# Altium schematic sheet 驱动板.SchDoc
size A3
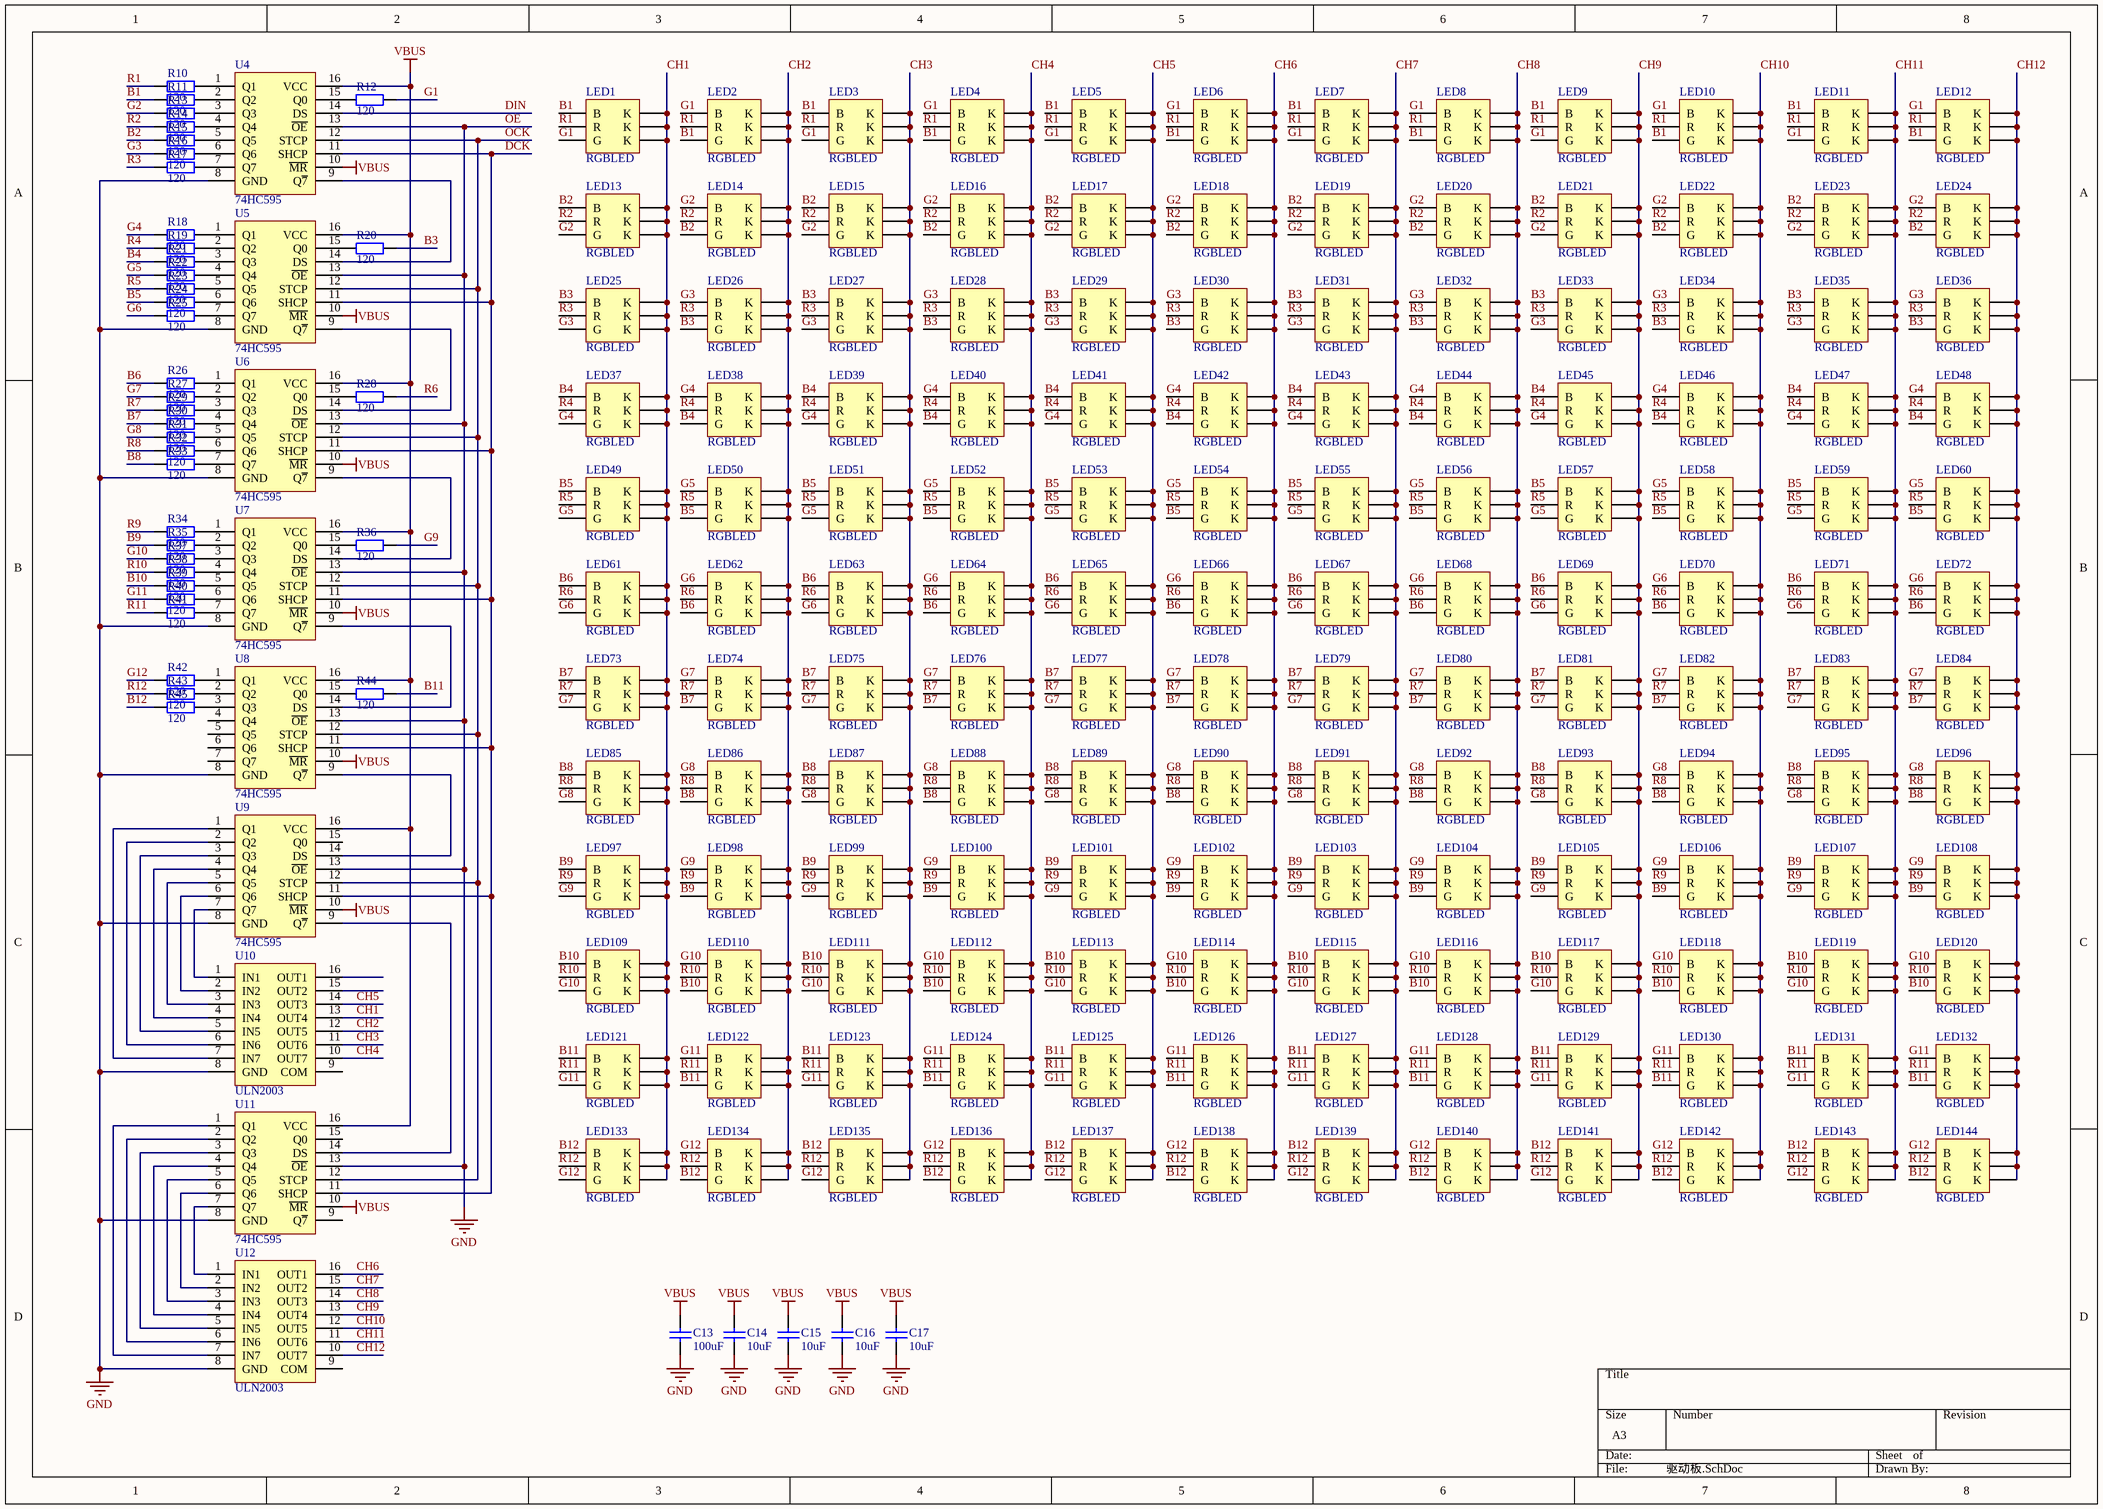
[diagram p0: 驱动板.SchDoc]

## Parts
C13  100uF  [2512]
C14  10uF  [0805]
C15  10uF  [0805]
C16  10uF  [0805]
C17  10uF  [0805]
LED1  RGBLED  [5050]
LED2  RGBLED  [5050]
LED3  RGBLED  [5050]
LED4  RGBLED  [5050]
LED5  RGBLED  [5050]
LED6  RGBLED  [5050]
LED7  RGBLED  [5050]
LED8  RGBLED  [5050]
LED9  RGBLED  [5050]
LED10  RGBLED  [5050]
LED11  RGBLED  [5050]
LED12  RGBLED  [5050]
LED13  RGBLED  [5050]
LED14  RGBLED  [5050]
LED15  RGBLED  [5050]
LED16  RGBLED  [5050]
LED17  RGBLED  [5050]
LED18  RGBLED  [5050]
LED19  RGBLED  [5050]
LED20  RGBLED  [5050]
LED21  RGBLED  [5050]
LED22  RGBLED  [5050]
LED23  RGBLED  [5050]
LED24  RGBLED  [5050]
LED25  RGBLED  [5050]
LED26  RGBLED  [5050]
LED27  RGBLED  [5050]
LED28  RGBLED  [5050]
LED29  RGBLED  [5050]
LED30  RGBLED  [5050]
LED31  RGBLED  [5050]
LED32  RGBLED  [5050]
LED33  RGBLED  [5050]
LED34  RGBLED  [5050]
LED35  RGBLED  [5050]
LED36  RGBLED  [5050]
LED37  RGBLED  [5050]
LED38  RGBLED  [5050]
LED39  RGBLED  [5050]
LED40  RGBLED  [5050]
LED41  RGBLED  [5050]
LED42  RGBLED  [5050]
LED43  RGBLED  [5050]
LED44  RGBLED  [5050]
LED45  RGBLED  [5050]
LED46  RGBLED  [5050]
LED47  RGBLED  [5050]
LED48  RGBLED  [5050]
LED49  RGBLED  [5050]
LED50  RGBLED  [5050]
LED51  RGBLED  [5050]
LED52  RGBLED  [5050]
LED53  RGBLED  [5050]
LED54  RGBLED  [5050]
LED55  RGBLED  [5050]
LED56  RGBLED  [5050]
LED57  RGBLED  [5050]
LED58  RGBLED  [5050]
LED59  RGBLED  [5050]
LED60  RGBLED  [5050]
LED61  RGBLED  [5050]
LED62  RGBLED  [5050]
LED63  RGBLED  [5050]
LED64  RGBLED  [5050]
LED65  RGBLED  [5050]
LED66  RGBLED  [5050]
LED67  RGBLED  [5050]
LED68  RGBLED  [5050]
LED69  RGBLED  [5050]
LED70  RGBLED  [5050]
LED71  RGBLED  [5050]
LED72  RGBLED  [5050]
LED73  RGBLED  [5050]
LED74  RGBLED  [5050]
LED75  RGBLED  [5050]
LED76  RGBLED  [5050]
LED77  RGBLED  [5050]
LED78  RGBLED  [5050]
LED79  RGBLED  [5050]
LED80  RGBLED  [5050]
LED81  RGBLED  [5050]
LED82  RGBLED  [5050]
LED83  RGBLED  [5050]
LED84  RGBLED  [5050]
LED85  RGBLED  [5050]
LED86  RGBLED  [5050]
LED87  RGBLED  [5050]
LED88  RGBLED  [5050]
LED89  RGBLED  [5050]
LED90  RGBLED  [5050]
LED91  RGBLED  [5050]
LED92  RGBLED  [5050]
LED93  RGBLED  [5050]
LED94  RGBLED  [5050]
LED95  RGBLED  [5050]
LED96  RGBLED  [5050]
LED97  RGBLED  [5050]
LED98  RGBLED  [5050]
LED99  RGBLED  [5050]
LED100  RGBLED  [5050]
LED101  RGBLED  [5050]
LED102  RGBLED  [5050]
LED103  RGBLED  [5050]
LED104  RGBLED  [5050]
LED105  RGBLED  [5050]
LED106  RGBLED  [5050]
LED107  RGBLED  [5050]
LED108  RGBLED  [5050]
LED109  RGBLED  [5050]
LED110  RGBLED  [5050]
LED111  RGBLED  [5050]
LED112  RGBLED  [5050]
LED113  RGBLED  [5050]
LED114  RGBLED  [5050]
LED115  RGBLED  [5050]
LED116  RGBLED  [5050]
LED117  RGBLED  [5050]
LED118  RGBLED  [5050]
LED119  RGBLED  [5050]
LED120  RGBLED  [5050]
LED121  RGBLED  [5050]
LED122  RGBLED  [5050]
LED123  RGBLED  [5050]
LED124  RGBLED  [5050]
LED125  RGBLED  [5050]
LED126  RGBLED  [5050]
LED127  RGBLED  [5050]
LED128  RGBLED  [5050]
LED129  RGBLED  [5050]
LED130  RGBLED  [5050]
LED131  RGBLED  [5050]
LED132  RGBLED  [5050]
LED133  RGBLED  [5050]
LED134  RGBLED  [5050]
LED135  RGBLED  [5050]
LED136  RGBLED  [5050]
LED137  RGBLED  [5050]
LED138  RGBLED  [5050]
LED139  RGBLED  [5050]
LED140  RGBLED  [5050]
LED141  RGBLED  [5050]
LED142  RGBLED  [5050]
LED143  RGBLED  [5050]
LED144  RGBLED  [5050]
R10  120  [0805]
R11  120  [0805]
R12  120  [0805]
R13  120  [0805]
R14  120  [0805]
R15  120  [0805]
R16  120  [0805]
R17  120  [0805]
R18  120  [0805]
R19  120  [0805]
R20  120  [0805]
R21  120  [0805]
R22  120  [0805]
R23  120  [0805]
R24  120  [0805]
R25  120  [0805]
R26  120  [0805]
R27  120  [0805]
R28  120  [0805]
R29  120  [0805]
R30  120  [0805]
R31  120  [0805]
R32  120  [0805]
R33  120  [0805]
R34  120  [0805]
R35  120  [0805]
R36  120  [0805]
R37  120  [0805]
R38  120  [0805]
R39  120  [0805]
R40  120  [0805]
R41  120  [0805]
R42  120  [0805]
R43  120  [0805]
R44  120  [0805]
R45  120  [0805]
U4  74HC595  [SO-16_N]
U5  74HC595  [SO-16_N]
U6  74HC595  [SO-16_N]
U7  74HC595  [SO-16_N]
U8  74HC595  [SO-16_N]
U9  74HC595  [SO-16_N]
U10  ULN2003  [SO-16_N]
U11  74HC595  [SO-16_N]
U12  ULN2003  [SO-16_N]

## Nets
OE: C13.2 C14.2 C15.2 C16.2 C17.2 U4.8(GND) U4.13(~{OE}) U5.8(GND) U5.13(~{OE}) U6.8(GND) U6.13(~{OE}) U7.8(GND) U7.13(~{OE}) U8.8(GND) U8.13(~{OE}) U9.8(GND) U9.13(~{OE}) U10.8(GND) U11.8(GND) U11.13(~{OE}) U12.8(GND)  [also labelled GND]
VBUS: C13.1 C14.1 C15.1 C16.1 C17.1 U4.10(~{MR}) U4.16(VCC) U5.10(~{MR}) U5.16(VCC) U6.10(~{MR}) U6.16(VCC) U7.10(~{MR}) U7.16(VCC) U8.10(~{MR}) U8.16(VCC) U9.10(~{MR}) U9.16(VCC) U11.10(~{MR}) U11.16(VCC)
B1: LED1.1(B) LED2.3(G) LED3.1(B) LED4.3(G) LED5.1(B) LED6.3(G) LED7.1(B) LED8.3(G) LED9.1(B) LED10.3(G) LED11.1(B) LED12.3(G) R11.1
B2: LED13.1(B) LED14.3(G) LED15.1(B) LED16.3(G) LED17.1(B) LED18.3(G) LED19.1(B) LED20.3(G) LED21.1(B) LED22.3(G) LED23.1(B) LED24.3(G) R15.1
B3: LED25.1(B) LED26.3(G) LED27.1(B) LED28.3(G) LED29.1(B) LED30.3(G) LED31.1(B) LED32.3(G) LED33.1(B) LED34.3(G) LED35.1(B) LED36.3(G) R20.2
B4: LED37.1(B) LED38.3(G) LED39.1(B) LED40.3(G) LED41.1(B) LED42.3(G) LED43.1(B) LED44.3(G) LED45.1(B) LED46.3(G) LED47.1(B) LED48.3(G) R21.1
B5: LED49.1(B) LED50.3(G) LED51.1(B) LED52.3(G) LED53.1(B) LED54.3(G) LED55.1(B) LED56.3(G) LED57.1(B) LED58.3(G) LED59.1(B) LED60.3(G) R24.1
B6: LED61.1(B) LED62.3(G) LED63.1(B) LED64.3(G) LED65.1(B) LED66.3(G) LED67.1(B) LED68.3(G) LED69.1(B) LED70.3(G) LED71.1(B) LED72.3(G) R26.1
B7: LED73.1(B) LED74.3(G) LED75.1(B) LED76.3(G) LED77.1(B) LED78.3(G) LED79.1(B) LED80.3(G) LED81.1(B) LED82.3(G) LED83.1(B) LED84.3(G) R30.1
B8: LED85.1(B) LED86.3(G) LED87.1(B) LED88.3(G) LED89.1(B) LED90.3(G) LED91.1(B) LED92.3(G) LED93.1(B) LED94.3(G) LED95.1(B) LED96.3(G) R33.1
B9: LED97.1(B) LED98.3(G) LED99.1(B) LED100.3(G) LED101.1(B) LED102.3(G) LED103.1(B) LED104.3(G) LED105.1(B) LED106.3(G) LED107.1(B) LED108.3(G) R35.1
B10: LED109.1(B) LED110.3(G) LED111.1(B) LED112.3(G) LED113.1(B) LED114.3(G) LED115.1(B) LED116.3(G) LED117.1(B) LED118.3(G) LED119.1(B) LED120.3(G) R39.1
B11: LED121.1(B) LED122.3(G) LED123.1(B) LED124.3(G) LED125.1(B) LED126.3(G) LED127.1(B) LED128.3(G) LED129.1(B) LED130.3(G) LED131.1(B) LED132.3(G) R44.2
B12: LED133.1(B) LED134.3(G) LED135.1(B) LED136.3(G) LED137.1(B) LED138.3(G) LED139.1(B) LED140.3(G) LED141.1(B) LED142.3(G) LED143.1(B) LED144.3(G) R45.1
CH1: LED1.4(K) LED1.5(K) LED1.6(K) LED13.4(K) LED13.5(K) LED13.6(K) LED25.4(K) LED25.5(K) LED25.6(K) LED37.4(K) LED37.5(K) LED37.6(K) LED49.4(K) LED49.5(K) LED49.6(K) LED61.4(K) LED61.5(K) LED61.6(K) LED73.4(K) LED73.5(K) LED73.6(K) LED85.4(K) LED85.5(K) LED85.6(K) LED97.4(K) LED97.5(K) LED97.6(K) LED109.4(K) LED109.5(K) LED109.6(K) LED121.4(K) LED121.5(K) LED121.6(K) LED133.4(K) LED133.5(K) LED133.6(K) U10.13(OUT4)
CH2: LED2.4(K) LED2.5(K) LED2.6(K) LED14.4(K) LED14.5(K) LED14.6(K) LED26.4(K) LED26.5(K) LED26.6(K) LED38.4(K) LED38.5(K) LED38.6(K) LED50.4(K) LED50.5(K) LED50.6(K) LED62.4(K) LED62.5(K) LED62.6(K) LED74.4(K) LED74.5(K) LED74.6(K) LED86.4(K) LED86.5(K) LED86.6(K) LED98.4(K) LED98.5(K) LED98.6(K) LED110.4(K) LED110.5(K) LED110.6(K) LED122.4(K) LED122.5(K) LED122.6(K) LED134.4(K) LED134.5(K) LED134.6(K) U10.12(OUT5)
CH3: LED3.4(K) LED3.5(K) LED3.6(K) LED15.4(K) LED15.5(K) LED15.6(K) LED27.4(K) LED27.5(K) LED27.6(K) LED39.4(K) LED39.5(K) LED39.6(K) LED51.4(K) LED51.5(K) LED51.6(K) LED63.4(K) LED63.5(K) LED63.6(K) LED75.4(K) LED75.5(K) LED75.6(K) LED87.4(K) LED87.5(K) LED87.6(K) LED99.4(K) LED99.5(K) LED99.6(K) LED111.4(K) LED111.5(K) LED111.6(K) LED123.4(K) LED123.5(K) LED123.6(K) LED135.4(K) LED135.5(K) LED135.6(K) U10.11(OUT6)
CH4: LED4.4(K) LED4.5(K) LED4.6(K) LED16.4(K) LED16.5(K) LED16.6(K) LED28.4(K) LED28.5(K) LED28.6(K) LED40.4(K) LED40.5(K) LED40.6(K) LED52.4(K) LED52.5(K) LED52.6(K) LED64.4(K) LED64.5(K) LED64.6(K) LED76.4(K) LED76.5(K) LED76.6(K) LED88.4(K) LED88.5(K) LED88.6(K) LED100.4(K) LED100.5(K) LED100.6(K) LED112.4(K) LED112.5(K) LED112.6(K) LED124.4(K) LED124.5(K) LED124.6(K) LED136.4(K) LED136.5(K) LED136.6(K) U10.10(OUT7)
CH5: LED5.4(K) LED5.5(K) LED5.6(K) LED17.4(K) LED17.5(K) LED17.6(K) LED29.4(K) LED29.5(K) LED29.6(K) LED41.4(K) LED41.5(K) LED41.6(K) LED53.4(K) LED53.5(K) LED53.6(K) LED65.4(K) LED65.5(K) LED65.6(K) LED77.4(K) LED77.5(K) LED77.6(K) LED89.4(K) LED89.5(K) LED89.6(K) LED101.4(K) LED101.5(K) LED101.6(K) LED113.4(K) LED113.5(K) LED113.6(K) LED125.4(K) LED125.5(K) LED125.6(K) LED137.4(K) LED137.5(K) LED137.6(K) U10.14(OUT3)
CH6: LED6.4(K) LED6.5(K) LED6.6(K) LED18.4(K) LED18.5(K) LED18.6(K) LED30.4(K) LED30.5(K) LED30.6(K) LED42.4(K) LED42.5(K) LED42.6(K) LED54.4(K) LED54.5(K) LED54.6(K) LED66.4(K) LED66.5(K) LED66.6(K) LED78.4(K) LED78.5(K) LED78.6(K) LED90.4(K) LED90.5(K) LED90.6(K) LED102.4(K) LED102.5(K) LED102.6(K) LED114.4(K) LED114.5(K) LED114.6(K) LED126.4(K) LED126.5(K) LED126.6(K) LED138.4(K) LED138.5(K) LED138.6(K) U12.16(OUT1)
CH7: LED7.4(K) LED7.5(K) LED7.6(K) LED19.4(K) LED19.5(K) LED19.6(K) LED31.4(K) LED31.5(K) LED31.6(K) LED43.4(K) LED43.5(K) LED43.6(K) LED55.4(K) LED55.5(K) LED55.6(K) LED67.4(K) LED67.5(K) LED67.6(K) LED79.4(K) LED79.5(K) LED79.6(K) LED91.4(K) LED91.5(K) LED91.6(K) LED103.4(K) LED103.5(K) LED103.6(K) LED115.4(K) LED115.5(K) LED115.6(K) LED127.4(K) LED127.5(K) LED127.6(K) LED139.4(K) LED139.5(K) LED139.6(K) U12.15(OUT2)
CH8: LED8.4(K) LED8.5(K) LED8.6(K) LED20.4(K) LED20.5(K) LED20.6(K) LED32.4(K) LED32.5(K) LED32.6(K) LED44.4(K) LED44.5(K) LED44.6(K) LED56.4(K) LED56.5(K) LED56.6(K) LED68.4(K) LED68.5(K) LED68.6(K) LED80.4(K) LED80.5(K) LED80.6(K) LED92.4(K) LED92.5(K) LED92.6(K) LED104.4(K) LED104.5(K) LED104.6(K) LED116.4(K) LED116.5(K) LED116.6(K) LED128.4(K) LED128.5(K) LED128.6(K) LED140.4(K) LED140.5(K) LED140.6(K) U12.14(OUT3)
CH9: LED9.4(K) LED9.5(K) LED9.6(K) LED21.4(K) LED21.5(K) LED21.6(K) LED33.4(K) LED33.5(K) LED33.6(K) LED45.4(K) LED45.5(K) LED45.6(K) LED57.4(K) LED57.5(K) LED57.6(K) LED69.4(K) LED69.5(K) LED69.6(K) LED81.4(K) LED81.5(K) LED81.6(K) LED93.4(K) LED93.5(K) LED93.6(K) LED105.4(K) LED105.5(K) LED105.6(K) LED117.4(K) LED117.5(K) LED117.6(K) LED129.4(K) LED129.5(K) LED129.6(K) LED141.4(K) LED141.5(K) LED141.6(K) U12.13(OUT4)
CH10: LED10.4(K) LED10.5(K) LED10.6(K) LED22.4(K) LED22.5(K) LED22.6(K) LED34.4(K) LED34.5(K) LED34.6(K) LED46.4(K) LED46.5(K) LED46.6(K) LED58.4(K) LED58.5(K) LED58.6(K) LED70.4(K) LED70.5(K) LED70.6(K) LED82.4(K) LED82.5(K) LED82.6(K) LED94.4(K) LED94.5(K) LED94.6(K) LED106.4(K) LED106.5(K) LED106.6(K) LED118.4(K) LED118.5(K) LED118.6(K) LED130.4(K) LED130.5(K) LED130.6(K) LED142.4(K) LED142.5(K) LED142.6(K) U12.12(OUT5)
CH11: LED11.4(K) LED11.5(K) LED11.6(K) LED23.4(K) LED23.5(K) LED23.6(K) LED35.4(K) LED35.5(K) LED35.6(K) LED47.4(K) LED47.5(K) LED47.6(K) LED59.4(K) LED59.5(K) LED59.6(K) LED71.4(K) LED71.5(K) LED71.6(K) LED83.4(K) LED83.5(K) LED83.6(K) LED95.4(K) LED95.5(K) LED95.6(K) LED107.4(K) LED107.5(K) LED107.6(K) LED119.4(K) LED119.5(K) LED119.6(K) LED131.4(K) LED131.5(K) LED131.6(K) LED143.4(K) LED143.5(K) LED143.6(K) U12.11(OUT6)
CH12: LED12.4(K) LED12.5(K) LED12.6(K) LED24.4(K) LED24.5(K) LED24.6(K) LED36.4(K) LED36.5(K) LED36.6(K) LED48.4(K) LED48.5(K) LED48.6(K) LED60.4(K) LED60.5(K) LED60.6(K) LED72.4(K) LED72.5(K) LED72.6(K) LED84.4(K) LED84.5(K) LED84.6(K) LED96.4(K) LED96.5(K) LED96.6(K) LED108.4(K) LED108.5(K) LED108.6(K) LED120.4(K) LED120.5(K) LED120.6(K) LED132.4(K) LED132.5(K) LED132.6(K) LED144.4(K) LED144.5(K) LED144.6(K) U12.10(OUT7)
DCK: U4.11(SHCP) U5.11(SHCP) U6.11(SHCP) U7.11(SHCP) U8.11(SHCP) U9.11(SHCP) U11.11(SHCP)
DIN: U4.14(DS)
G1: LED1.3(G) LED2.1(B) LED3.3(G) LED4.1(B) LED5.3(G) LED6.1(B) LED7.3(G) LED8.1(B) LED9.3(G) LED10.1(B) LED11.3(G) LED12.1(B) R12.2
G2: LED13.3(G) LED14.1(B) LED15.3(G) LED16.1(B) LED17.3(G) LED18.1(B) LED19.3(G) LED20.1(B) LED21.3(G) LED22.1(B) LED23.3(G) LED24.1(B) R13.1
G3: LED25.3(G) LED26.1(B) LED27.3(G) LED28.1(B) LED29.3(G) LED30.1(B) LED31.3(G) LED32.1(B) LED33.3(G) LED34.1(B) LED35.3(G) LED36.1(B) R16.1
G4: LED37.3(G) LED38.1(B) LED39.3(G) LED40.1(B) LED41.3(G) LED42.1(B) LED43.3(G) LED44.1(B) LED45.3(G) LED46.1(B) LED47.3(G) LED48.1(B) R18.1
G5: LED49.3(G) LED50.1(B) LED51.3(G) LED52.1(B) LED53.3(G) LED54.1(B) LED55.3(G) LED56.1(B) LED57.3(G) LED58.1(B) LED59.3(G) LED60.1(B) R22.1
G6: LED61.3(G) LED62.1(B) LED63.3(G) LED64.1(B) LED65.3(G) LED66.1(B) LED67.3(G) LED68.1(B) LED69.3(G) LED70.1(B) LED71.3(G) LED72.1(B) R25.1
G7: LED73.3(G) LED74.1(B) LED75.3(G) LED76.1(B) LED77.3(G) LED78.1(B) LED79.3(G) LED80.1(B) LED81.3(G) LED82.1(B) LED83.3(G) LED84.1(B) R27.1
G8: LED85.3(G) LED86.1(B) LED87.3(G) LED88.1(B) LED89.3(G) LED90.1(B) LED91.3(G) LED92.1(B) LED93.3(G) LED94.1(B) LED95.3(G) LED96.1(B) R31.1
G9: LED97.3(G) LED98.1(B) LED99.3(G) LED100.1(B) LED101.3(G) LED102.1(B) LED103.3(G) LED104.1(B) LED105.3(G) LED106.1(B) LED107.3(G) LED108.1(B) R36.2
G10: LED109.3(G) LED110.1(B) LED111.3(G) LED112.1(B) LED113.3(G) LED114.1(B) LED115.3(G) LED116.1(B) LED117.3(G) LED118.1(B) LED119.3(G) LED120.1(B) R37.1
G11: LED121.3(G) LED122.1(B) LED123.3(G) LED124.1(B) LED125.3(G) LED126.1(B) LED127.3(G) LED128.1(B) LED129.3(G) LED130.1(B) LED131.3(G) LED132.1(B) R40.1
G12: LED133.3(G) LED134.1(B) LED135.3(G) LED136.1(B) LED137.3(G) LED138.1(B) LED139.3(G) LED140.1(B) LED141.3(G) LED142.1(B) LED143.3(G) LED144.1(B) R42.1
OCK: U4.12(STCP) U5.12(STCP) U6.12(STCP) U7.12(STCP) U8.12(STCP) U9.12(STCP) U11.12(STCP)
R1: LED1.2(R) LED2.2(R) LED3.2(R) LED4.2(R) LED5.2(R) LED6.2(R) LED7.2(R) LED8.2(R) LED9.2(R) LED10.2(R) LED11.2(R) LED12.2(R) R10.1
R2: LED13.2(R) LED14.2(R) LED15.2(R) LED16.2(R) LED17.2(R) LED18.2(R) LED19.2(R) LED20.2(R) LED21.2(R) LED22.2(R) LED23.2(R) LED24.2(R) R14.1
R3: LED25.2(R) LED26.2(R) LED27.2(R) LED28.2(R) LED29.2(R) LED30.2(R) LED31.2(R) LED32.2(R) LED33.2(R) LED34.2(R) LED35.2(R) LED36.2(R) R17.1
R4: LED37.2(R) LED38.2(R) LED39.2(R) LED40.2(R) LED41.2(R) LED42.2(R) LED43.2(R) LED44.2(R) LED45.2(R) LED46.2(R) LED47.2(R) LED48.2(R) R19.1
R5: LED49.2(R) LED50.2(R) LED51.2(R) LED52.2(R) LED53.2(R) LED54.2(R) LED55.2(R) LED56.2(R) LED57.2(R) LED58.2(R) LED59.2(R) LED60.2(R) R23.1
R6: LED61.2(R) LED62.2(R) LED63.2(R) LED64.2(R) LED65.2(R) LED66.2(R) LED67.2(R) LED68.2(R) LED69.2(R) LED70.2(R) LED71.2(R) LED72.2(R) R28.2
R7: LED73.2(R) LED74.2(R) LED75.2(R) LED76.2(R) LED77.2(R) LED78.2(R) LED79.2(R) LED80.2(R) LED81.2(R) LED82.2(R) LED83.2(R) LED84.2(R) R29.1
R8: LED85.2(R) LED86.2(R) LED87.2(R) LED88.2(R) LED89.2(R) LED90.2(R) LED91.2(R) LED92.2(R) LED93.2(R) LED94.2(R) LED95.2(R) LED96.2(R) R32.1
R9: LED97.2(R) LED98.2(R) LED99.2(R) LED100.2(R) LED101.2(R) LED102.2(R) LED103.2(R) LED104.2(R) LED105.2(R) LED106.2(R) LED107.2(R) LED108.2(R) R34.1
R10: LED109.2(R) LED110.2(R) LED111.2(R) LED112.2(R) LED113.2(R) LED114.2(R) LED115.2(R) LED116.2(R) LED117.2(R) LED118.2(R) LED119.2(R) LED120.2(R) R38.1
R11: LED121.2(R) LED122.2(R) LED123.2(R) LED124.2(R) LED125.2(R) LED126.2(R) LED127.2(R) LED128.2(R) LED129.2(R) LED130.2(R) LED131.2(R) LED132.2(R) R41.1
R12: LED133.2(R) LED134.2(R) LED135.2(R) LED136.2(R) LED137.2(R) LED138.2(R) LED139.2(R) LED140.2(R) LED141.2(R) LED142.2(R) LED143.2(R) LED144.2(R) R43.1
NetR10_2: R10.2 U4.1(Q1)
NetR11_2: R11.2 U4.2(Q2)
NetR12_1: R12.1 U4.15(Q0)
NetR13_2: R13.2 U4.3(Q3)
NetR14_2: R14.2 U4.4(Q4)
NetR15_2: R15.2 U4.5(Q5)
NetR16_2: R16.2 U4.6(Q6)
NetR17_2: R17.2 U4.7(Q7)
NetR18_2: R18.2 U5.1(Q1)
NetR19_2: R19.2 U5.2(Q2)
NetR20_1: R20.1 U5.15(Q0)
NetR21_2: R21.2 U5.3(Q3)
NetR22_2: R22.2 U5.4(Q4)
NetR23_2: R23.2 U5.5(Q5)
NetR24_2: R24.2 U5.6(Q6)
NetR25_2: R25.2 U5.7(Q7)
NetR26_2: R26.2 U6.1(Q1)
NetR27_2: R27.2 U6.2(Q2)
NetR28_1: R28.1 U6.15(Q0)
NetR29_2: R29.2 U6.3(Q3)
NetR30_2: R30.2 U6.4(Q4)
NetR31_2: R31.2 U6.5(Q5)
NetR32_2: R32.2 U6.6(Q6)
NetR33_2: R33.2 U6.7(Q7)
NetR34_2: R34.2 U7.1(Q1)
NetR35_2: R35.2 U7.2(Q2)
NetR36_1: R36.1 U7.15(Q0)
NetR37_2: R37.2 U7.3(Q3)
NetR38_2: R38.2 U7.4(Q4)
NetR39_2: R39.2 U7.5(Q5)
NetR40_2: R40.2 U7.6(Q6)
NetR41_2: R41.2 U7.7(Q7)
NetR42_2: R42.2 U8.1(Q1)
NetR43_2: R43.2 U8.2(Q2)
NetR44_1: R44.1 U8.15(Q0)
NetR45_2: R45.2 U8.3(Q3)
NetU4_9: U4.9(Q~{7}) U5.14(DS)
NetU5_9: U5.9(Q~{7}) U6.14(DS)
NetU6_9: U6.9(Q~{7}) U7.14(DS)
NetU7_9: U7.9(Q~{7}) U8.14(DS)
NetU8_9: U8.9(Q~{7}) U9.14(DS)
NetU9_1: U9.1(Q1) U10.7(IN7)
NetU9_2: U9.2(Q2) U10.6(IN6)
NetU9_3: U9.3(Q3) U10.5(IN5)
NetU9_4: U9.4(Q4) U10.4(IN4)
NetU9_5: U9.5(Q5) U10.3(IN3)
NetU9_6: U9.6(Q6) U10.2(IN2)
NetU9_7: U9.7(Q7) U10.1(IN1)
NetU9_9: U9.9(Q~{7}) U11.14(DS)
NetU11_1: U11.1(Q1) U12.7(IN7)
NetU11_2: U11.2(Q2) U12.6(IN6)
NetU11_3: U11.3(Q3) U12.5(IN5)
NetU11_4: U11.4(Q4) U12.4(IN4)
NetU11_5: U11.5(Q5) U12.3(IN3)
NetU11_6: U11.6(Q6) U12.2(IN2)
NetU11_7: U11.7(Q7) U12.1(IN1)

Not connected (* = marked no-connect by the designer): U8 4(Q4) 5(Q5) 6(Q6) 7(Q7); U9 15(Q0); U10 9(COM) 15(OUT2) 16(OUT1); U11 9(Q~{7}) 15(Q0); U12 9(COM)

## Library data of the parts
C13-C17 = Cap: Capacitor; Value: 100pF; Published: 8-Jun-2000; LatestRevisionDate: 17-Jul-2002; LatestRevisionNote: Re-released for DXP Platform.; PackageReference: RAD-0.3; Publisher: Altium Limited; PackageDescription: Radial Cap, Thru-Hole; 2 Leads; 0.3 in Pin Spacing
R10-R45 = Res2: Resistor; Value: 1K; Published: 8-Jun-2000; LatestRevisionDate: 17-Jul-2002; LatestRevisionNote: Re-released for DXP Platform.; PackageReference: AXIAL-0.4; Publisher: Altium Limited; PackageDescription: Axial Device, Thru-Hole; 2 Leads; 0.4 in Pin Spacing